# EAGLE schematic flute (EAGLE 6.1)
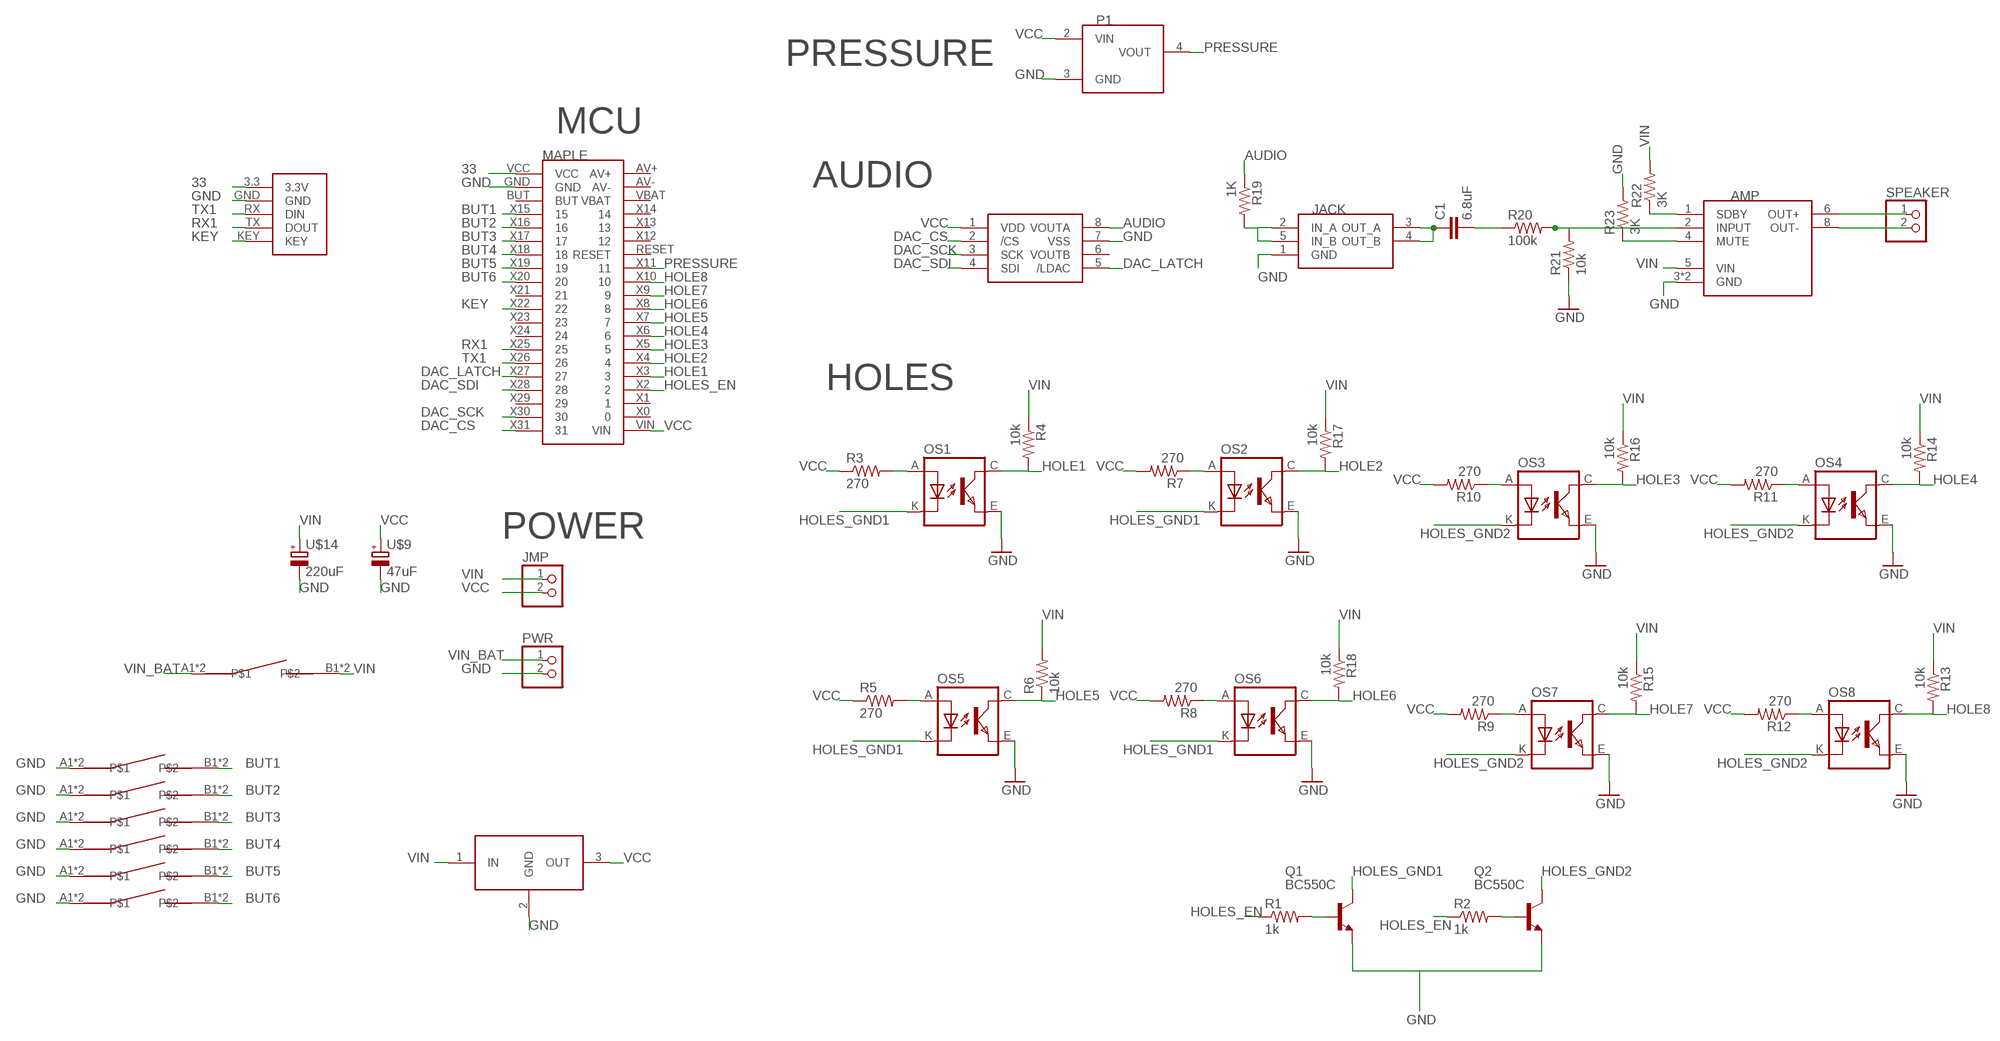
[diagram p0: schematic, sheet 1]

## Parts
AMP  AN7511DIP8  [DIL08]
C1  6.8uF  CAP0805  [0805]
JACK  JACK  [3F07]
JMP  CONNEC_1X02BASIC  [CONNEC_1X02]
MAPLE  MAPLE_MINI  [CONNEC_2X20]
OS1  TCRT5000  [TCRT5000]
OS2  TCRT5000  [TCRT5000]
OS3  TCRT5000  [TCRT5000]
OS4  TCRT5000  [TCRT5000]
OS5  TCRT5000  [TCRT5000]
OS6  TCRT5000  [TCRT5000]
OS7  TCRT5000  [TCRT5000]
OS8  TCRT5000  [TCRT5000]
P1  PRESSURE_SENSOR  [MPXV5050GP]
PWR  CONNEC_1X02BASIC  [CONNEC_1X02]
Q1  BC550C  [TO92-EBC]
Q2  BC550C  [TO92-EBC]
R1  1k  RESISTOR0805-RES  [0805]
R2  1k  RESISTOR0805-RES  [0805]
R3  270  RESISTOR0805-RES  [0805]
R4  10k  RESISTOR0805-RES  [0805]
R5  270  RESISTOR0805-RES  [0805]
R6  10k  RESISTOR0805-RES  [0805]
R7  270  RESISTOR0805-RES  [0805]
R8  270  RESISTOR0805-RES  [0805]
R9  270  RESISTOR0805-RES  [0805]
R10  270  RESISTOR0805-RES  [0805]
R11  270  RESISTOR0805-RES  [0805]
R12  270  RESISTOR0805-RES  [0805]
R13  10k  RESISTOR0805-RES  [0805]
R14  10k  RESISTOR0805-RES  [0805]
R15  10k  RESISTOR0805-RES  [0805]
R16  10k  RESISTOR0805-RES  [0805]
R17  10k  RESISTOR0805-RES  [0805]
R18  10k  RESISTOR0805-RES  [0805]
R19  1K  RESISTOR0805-RES  [0805]
R20  100k  RESISTOR0805-RES  [0805]
R21  10k  RESISTOR0805-RES  [0805]
R22  3K  RESISTOR0805-RES  [0805]
R23  3K  RESISTOR0805-RES  [0805]
SPEAKER  CONNEC_1X02BASIC  [CONNEC_1X02]
U$9  47uF  CPOL_EUPANASONIC_D  [PANASONIC_D]
U$14  220uF  CPOL_EUPANASONIC_D8  [PANASONIC_D8]
U$16  SWITCHKCD11  [KCD11]
U$17  MCP4822  RHOBAN_MCP4822  [DIL08]
U$18  SWITCH6X6X10  [SWITCH_6X6X10]
U$19  SWITCH6X6X10  [SWITCH_6X6X10]
U$20  SWITCH6X6X10  [SWITCH_6X6X10]
U$21  SWITCH6X6X10  [SWITCH_6X6X10]
U$22  SWITCH6X6X10  [SWITCH_6X6X10]
U$23  SWITCH6X6X10  [SWITCH_6X6X10]
U$24  HC05  [HC-05]
U$25  MCP1703T-5002EDB  [SOT223]

## Nets
33: MAPLE.VCC U$24.3.3(3.3V)
AUDIO: R19.1 U$17.8(VOUTA)
BUT1: MAPLE.X15 U$18.B1 U$18.B2
BUT2: MAPLE.X16 U$19.B1 U$19.B2
BUT3: MAPLE.X17 U$20.B1 U$20.B2
BUT4: MAPLE.X18 U$21.B1 U$21.B2
BUT5: MAPLE.X19 U$22.B1 U$22.B2
BUT6: MAPLE.X20 U$23.B1 U$23.B2
DAC_CS: MAPLE.X31 U$17.2(/CS)
DAC_LATCH: MAPLE.X27 U$17.5(/LDAC)
DAC_SCK: MAPLE.X30 U$17.3(SCK)
DAC_SDI: MAPLE.X28 U$17.4(SDI)
GND [alim]: AMP.3(GND) AMP.7(GND) JACK.1(GND) MAPLE.GND OS1.E(EMITTER) OS2.E(EMITTER) OS3.E(EMITTER) OS4.E(EMITTER) OS5.E(EMITTER) OS6.E(EMITTER) OS7.E(EMITTER) OS8.E(EMITTER) P1.3(GND) PWR.2 Q1.E Q2.E R21.1 R23.2 U$9.- U$14.- U$17.7(VSS) U$18.A1 U$18.A2 U$19.A1 U$19.A2 U$20.A1 U$20.A2 U$21.A1 U$21.A2 U$22.A1 U$22.A2 U$23.A1 U$23.A2 U$24.GND U$25.2(GND)
HOLE1: MAPLE.X3 OS1.C(COLLECTOR) R4.2
HOLE2: MAPLE.X4 OS2.C(COLLECTOR) R17.2
HOLE3: MAPLE.X5 OS3.C(COLLECTOR) R16.2
HOLE4: MAPLE.X6 OS4.C(COLLECTOR) R14.2
HOLE5: MAPLE.X7 OS5.C(COLLECTOR) R6.1
HOLE6: MAPLE.X8 OS6.C(COLLECTOR) R18.2
HOLE7: MAPLE.X9 OS7.C(COLLECTOR) R15.2
HOLE8: MAPLE.X10 OS8.C(COLLECTOR) R13.2
HOLES_EN: MAPLE.X2 R1.1 R2.1
HOLES_GND1: OS1.K(CATHODE) OS2.K(CATHODE) OS5.K(CATHODE) OS6.K(CATHODE) Q1.C
HOLES_GND2: OS3.K(CATHODE) OS4.K(CATHODE) OS7.K(CATHODE) OS8.K(CATHODE) Q2.C
KEY: MAPLE.X22 U$24.KEY
N$1: AMP.6(OUT+) SPEAKER.1
N$2: AMP.8(OUT-) SPEAKER.2
N$3: Q1.B R1.2
N$4: Q2.B R2.2
N$5: OS1.A(ANODE) R3.2
N$7: OS2.A(ANODE) R7.1
N$8: JACK.2(IN_A) JACK.5(IN_B) R19.2
N$9: OS3.A(ANODE) R10.1
N$10: AMP.4(MUTE) R23.1
N$11: OS4.A(ANODE) R11.1
N$12: C1.2 R20.1
N$13: OS5.A(ANODE) R5.2
N$14: AMP.1(SDBY) R22.1
N$15: OS6.A(ANODE) R8.1
N$17: OS7.A(ANODE) R9.1
N$18: AMP.2(INPUT) R20.2 R21.2
N$19: OS8.A(ANODE) R12.1
N$20: C1.1 JACK.3(OUT_A) JACK.4(OUT_B)
PRESSURE: MAPLE.X11 P1.4(VOUT)
RX1: MAPLE.X25 U$24.TX(DOUT)
TX1: MAPLE.X26 U$24.RX(DIN)
VCC: JMP.2 MAPLE.VIN P1.2(VIN) R3.1 R5.1 R7.2 R8.2 R9.2 R10.2 R11.2 R12.2 U$9.+ U$17.1(VDD) U$25.3(OUT)
VIN [alim]: AMP.5(VIN) JMP.1 R4.1 R6.2 R13.1 R14.1 R15.1 R16.1 R17.1 R18.1 R22.2 U$14.+ U$16.B1 U$16.B2 U$25.1(IN)
VIN_BAT [alim]: PWR.1 U$16.A1 U$16.A2
Unconnected: MAPLE.AV+ MAPLE.AV- MAPLE.BUT MAPLE.RESET MAPLE.VBAT MAPLE.X0 MAPLE.X1 MAPLE.X12 MAPLE.X13 MAPLE.X14 MAPLE.X21 MAPLE.X23 MAPLE.X24 MAPLE.X29 U$17.6(VOUTB)

## Notes on the sheet
- PRESSURE
- MCU
- AUDIO
- HOLES
- POWER

## Library data of the parts
AMP = rhoban:AN7511
C1 = SparkFun-Passives:CAP: Capacitor Standard 0603 ceramic capacitor, and 0.1" leaded capacitor.
JACK = rhoban:JACK
JMP PWR SPEAKER = rhoban:CONNEC_1X02
MAPLE = rhoban:MAPLE_MINI
OS1-OS8 = tcrt5000:TCRT5000
P1 = rhoban:PRESSURE_SENSOR
Q1 Q2 = transistor-npn:BC550*: NPN Transistor
R1-R23 = SparkFun-Passives:RESISTOR: Resistor Basic schematic elements and footprints for 0603, 1206, and PTH resistors.
U$9 U$14 = rhoban:CPOL_EU: 47uF: http://fr.farnell.com/panasonic-electronic-components/eee1ca470sp/condensateur-elec-alu-47uf-16v/dp/9696946 220uF: http://fr.farnell.com/panasonic-electronic-components/eeefk1c221xp/condensateur-elec-alu-220uf-16v/dp/1850103
U$16 U$18-U$23 = rhoban:SWITCH
U$17 = rhoban:RHOBAN_MCP4822
U$24 = rhoban:HC05
U$25 = rhoban:MCP1703T-5002EDB

## Net classes
0 default: width 0.305 mm
1 alim: width 0.762 mm, clearance 0.076 mm